# Altium schematic sheet Peripherals.SchDoc
size A4; SheetNumber: 2; SheetTotal: 2
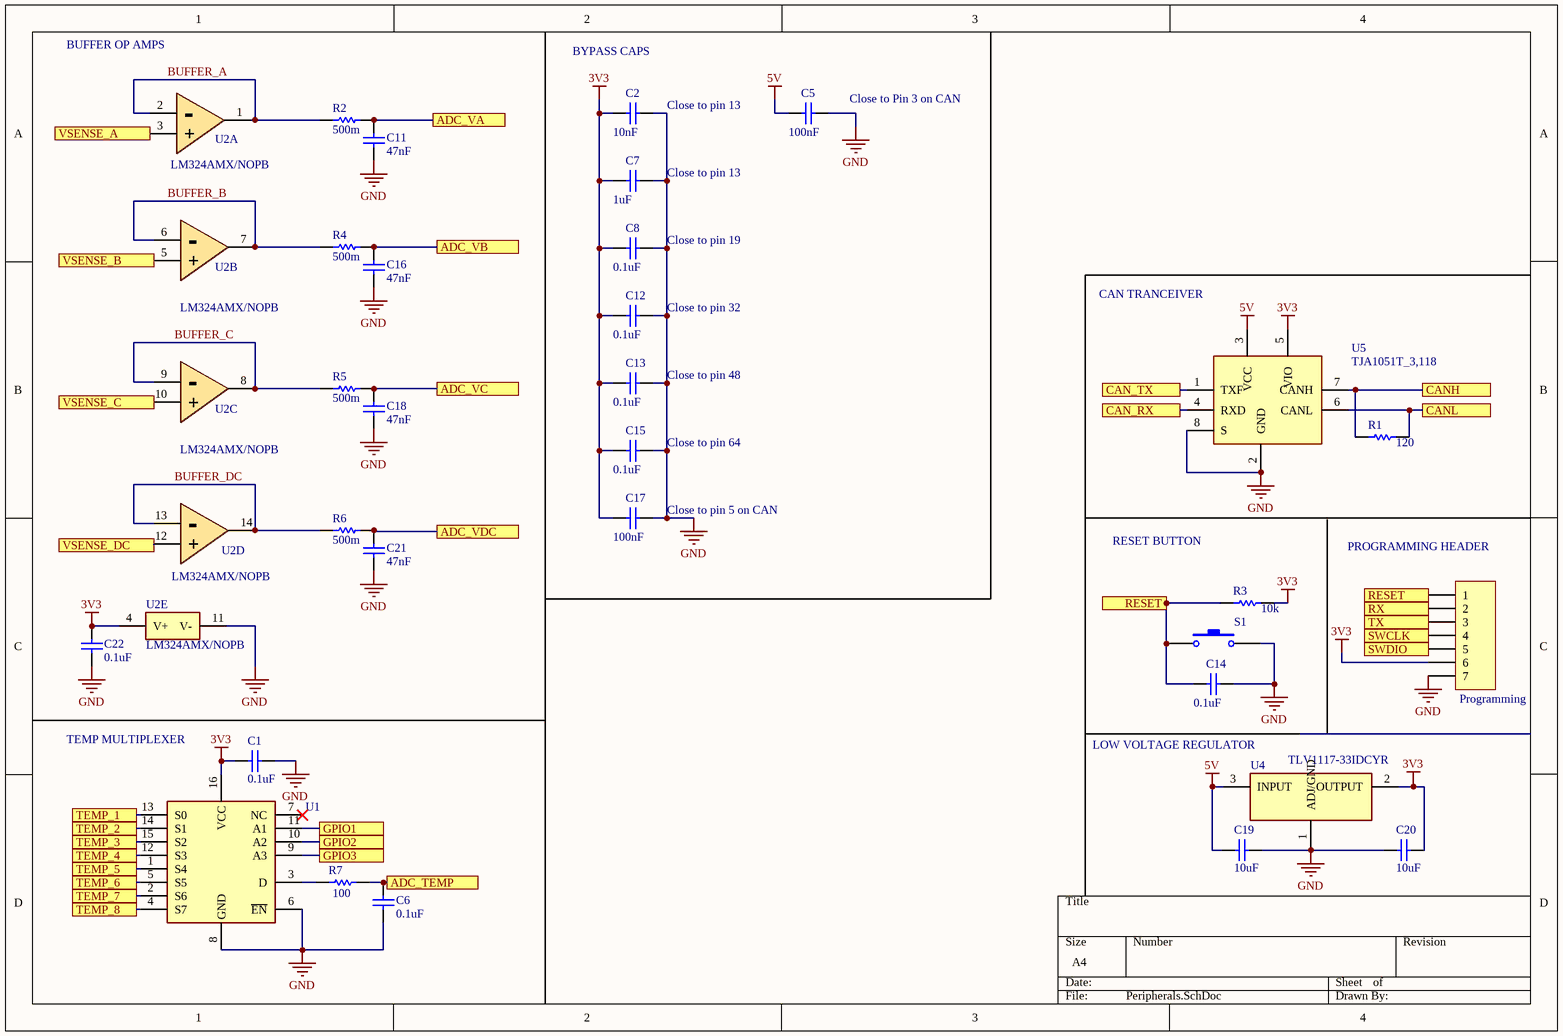
[diagram p0: Peripherals.SchDoc]

## Parts
C1  value 0.1uF  [0805 - Capacitor]  (hidden comment: Capacitor - Nonpolarized)
C2  value 10nF  [0805 - Capacitor]  (hidden comment: 10V)
C5  value 100nF  [0805 - Capacitor]  (hidden comment: Capacitor - Nonpolarized)
C6  value 0.1uF  [0805 - Capacitor]  (hidden comment: Capacitor - Nonpolarized)
C7  value 1uF  [0805 - Capacitor]  (hidden comment: 100V)
C8  value 0.1uF  [0805 - Capacitor]  (hidden comment: 100V)
C11  value 47nF  [0805 - Capacitor]  (hidden comment: Capacitor - Nonpolarized)
C12  value 0.1uF  [0805 - Capacitor]  (hidden comment: 100V)
C13  value 0.1uF  [0805 - Capacitor]  (hidden comment: 100V)
C14  value 0.1uF  [0805 - Capacitor]  (hidden comment: 100V)
C15  value 0.1uF  [0805 - Capacitor]  (hidden comment: 100V)
C16  value 47nF  [0805 - Capacitor]  (hidden comment: Capacitor - Nonpolarized)
C17  value 100nF  [0805 - Capacitor]  (hidden comment: Capacitor - Nonpolarized)
C18  value 47nF  [0805 - Capacitor]  (hidden comment: Capacitor - Nonpolarized)
C19  value 10uF  [0805 - Capacitor]  (hidden comment: Capacitor - Nonpolarized)
C20  value 10uF  [0805 - Capacitor]  (hidden comment: Capacitor - Nonpolarized)
C21  value 47nF  [0805 - Capacitor]  (hidden comment: Capacitor - Nonpolarized)
C22  value 0.1uF  [0805 - Capacitor]  (hidden comment: Capacitor - Nonpolarized)
Programming  Programming  [HDR1X7]  (value not drawn)
R1  value 120  [0603 - Resistor]  (hidden comment: 10k)
R2  value 500m  [0603 - Resistor]  (hidden comment: Resistor)
R3  10k  [0603 - Resistor]
R4  value 500m  [0603 - Resistor]  (hidden comment: Resistor)
R5  value 500m  [0603 - Resistor]  (hidden comment: Resistor)
R6  value 500m  [0603 - Resistor]  (hidden comment: Resistor)
R7  value 100  [0603 - Resistor]  (hidden comment: Resistor)
S1  Switch - Push Button  [6x6mm Switch]  (value not drawn)
U1  NX3L4051PW,118  [SOP65P640X120-16N]  (value not drawn)
U2  LM324AMX/NOPB  [LM324AMX/NOPB]  (parts A,B,C,D,E of 5)
U4  TLV1117-33IDCYR  [TLV1117]
U5  TJA1051T_3,118  [TJA1051T/3,118]

## Ports
ADC_TEMP, ADC_VA, ADC_VB, ADC_VC, ADC_VDC, CAN_RX, CAN_TX, CANH, CANL, GPIO1, GPIO2, GPIO3, RESET, RX, SWCLK, SWDIO, TEMP_1, TEMP_2, TEMP_3, TEMP_4, TEMP_5, TEMP_6, TEMP_7, TEMP_8, TX, VSENSE_A, VSENSE_B, VSENSE_C, VSENSE_DC

## Nets
3V3: C1.1 C2.1 C7.1 C8.1 C12.1 C13.1 C15.1 C17.2 C20.2 C22.1 Programming.6 R3.1 U1.16(VCC) U2.4(V+) U4.2(OUTPUT) U5.5(VIO)
5V: C5.2 C19.2 U4.3(INPUT) U5.3(VCC)
GND: C1.2 C2.2 C5.1 C6.1 C7.2 C8.2 C11.1 C12.2 C13.2 C14.2 C15.2 C16.1 C17.1 C18.1 C19.1 C20.1 C21.1 C22.2 Programming.7 S1.2 U1.6(~{EN}) U1.8(GND) U2.11(V-) U4.1(ADJ/GND) U5.2(GND) U5.8(S)
ADC_TEMP: C6.2 R7.1 ; port ADC_TEMP
ADC_VA: C11.2 R2.2 ; port ADC_VA
ADC_VB: C16.2 R4.2 ; port ADC_VB
ADC_VC: C18.2 R5.2 ; port ADC_VC
ADC_VDC: C21.2 R6.2 ; port ADC_VDC
BUFFER_A: R2.1 U2.1 U2.2(-)
BUFFER_B: R4.1 U2.6(-) U2.7
BUFFER_C: R5.1 U2.8 U2.9(-)
BUFFER_DC: R6.1 U2.13(-) U2.14
CAN_RX: U5.4(RXD) ; port CAN_RX
CAN_TX: U5.1(TXF) ; port CAN_TX
CANH: R1.2 U5.7(CANH) ; port CANH
CANL: R1.1 U5.6(CANL) ; port CANL
GPIO1: U1.11(A1) ; port GPIO1
GPIO2: U1.10(A2) ; port GPIO2
GPIO3: U1.9(A3) ; port GPIO3
RESET: C14.1 Programming.1 R3.2 S1.1 ; port RESET
RX: Programming.2 ; port RX
SWCLK: Programming.4 ; port SWCLK
SWDIO: Programming.5 ; port SWDIO
TEMP_1: U1.13(S0) ; port TEMP_1
TEMP_2: U1.14(S1) ; port TEMP_2
TEMP_3: U1.15(S2) ; port TEMP_3
TEMP_4: U1.12(S3) ; port TEMP_4
TEMP_5: U1.1(S4) ; port TEMP_5
TEMP_6: U1.5(S5) ; port TEMP_6
TEMP_7: U1.2(S6) ; port TEMP_7
TEMP_8: U1.4(S7) ; port TEMP_8
TX: Programming.3 ; port TX
VSENSE_A: U2.3(+) ; port VSENSE_A
VSENSE_B: U2.5(+) ; port VSENSE_B
VSENSE_C: U2.10(+) ; port VSENSE_C
VSENSE_DC: U2.12(+) ; port VSENSE_DC
NetR7_2: R7.2 U1.3(D)

Not connected (* = marked no-connect by the designer): U1 7(NC)*

## Notes on the sheet
- BUFFER OP AMPS
- BYPASS CAPS
- Close to pin 13
- (near C5) Close to Pin 3 on CAN
- (near C7) Close to pin 13
- (near C8) Close to pin 19
- (near C12) Close to pin 32
- CAN TRANCEIVER
- (near C13) Close to pin 48
- (near C15) Close to pin 64
- (near C17) Close to pin 5 on CAN
- RESET BUTTON
- (near Programming) PROGRAMMING HEADER
- TEMP MULTIPLEXER
- LOW VOLTAGE REGULATOR

## Library data of the parts
C1 C2 C5-C8 C11-C22 = Capacitor - Nonpolarized: Nonpolarized Capacitor; Supplier: *; Manufacturer: *; Rating: *; Manufacturer Part Number: *
  C1 C6 C8 C12-C15 C22: Supplier Part Number: 311-1141-1-ND
  C2: Supplier Part Number: 311-1475-1-ND
  C5 C17: Supplier Part Number: 311-3420-1-ND
  C7: Supplier Part Number: 311-1456-1-ND
  C11 C16 C18 C21: Supplier Part Number: 311-1431-1-ND
  C19 C20: Supplier Part Number: 13-CC0805KFX7R6BB106CT-ND
Programming = 1x7 Header: 1x7 Pin Header
R1 R3 = Resistor: Rating: *; Manufacturer Part Number: *; Manufacturer: *; Supplier Part Number: 311-10.0KHRCT-ND; Supplier: *
  R3: Value: 10k
S1 = Switch - Push Button: Push Button Switch; Supplier: *; Manufacturer Part Number: *; Manufacturer: *; Supplier Part Number: *; Rating: *; Value: *
U1 = NX3L4051PW,118: 8:1 MUX; Manufacturer: NXP; Manufacturer Part Number: NX3L4051PW,118; Supplier Part Number: 568-12393-1-ND; Supplier: Digikey; ComponentLink1Description: Datsheet; ComponentLink1URL: https://www.nxp.com/docs/en/data-sheet/NX3L4051.pdf
U2 = LM324AMX/NOPB: Gen Purp 4Ch Opamp; Manufacturer: TI; Manufacturer Part Number: LM324AMX/NOPB; Supplier Part Number: LM324AMX/NOPBCT-ND; Supplier: Digikey; ComponentLink1Description: Datasheet; ComponentLink1URL: https://www.ti.com/lit/ds/symlink/lm124-n.pdf?HQS=dis-dk-null-digikeymode-dsf-pf-null-wwe&ts=1616555832552
U4 = TLV1117-33IDCYR: Linear Voltage Regulator IC 3.3V 800MA SOT223-4; Manufacturer: Texas Instruments; Manufacturer Part Number: TLV1117-33IDCYR; Supplier Part Number: 296-21112-1-ND; Supplier: Digikey; ComponentLink1Description: Datasheet; ComponentLink1URL: http://www.ti.com/lit/ds/symlink/tlv1117.pdf?HQS=TI-null-null-digikeymode-df-pf-null-wwe&ts=1590668900314
U5 = TJA1051T_3,118: CAN Transceiver IC 4.5V-5.5V 250ns; Manufacturer: NXP; Manufacturer Part Number: TJA1051T/3,118; Supplier Part Number: 568-8684-1-ND; Supplier: Digikey; ComponentLink1Description: Datasheet; ComponentLink1URL: http://www.nxp.com/docs/en/data-sheet/TJA1051.pdf
R2 R4-R7 = Resistor: Rating: *; Manufacturer Part Number: *; Manufacturer: *; Supplier: *
  R2 R4-R6: Supplier Part Number: 13-RL0603JR-070R5LCT-ND
  R7: Supplier Part Number: 311-100HRCT-ND